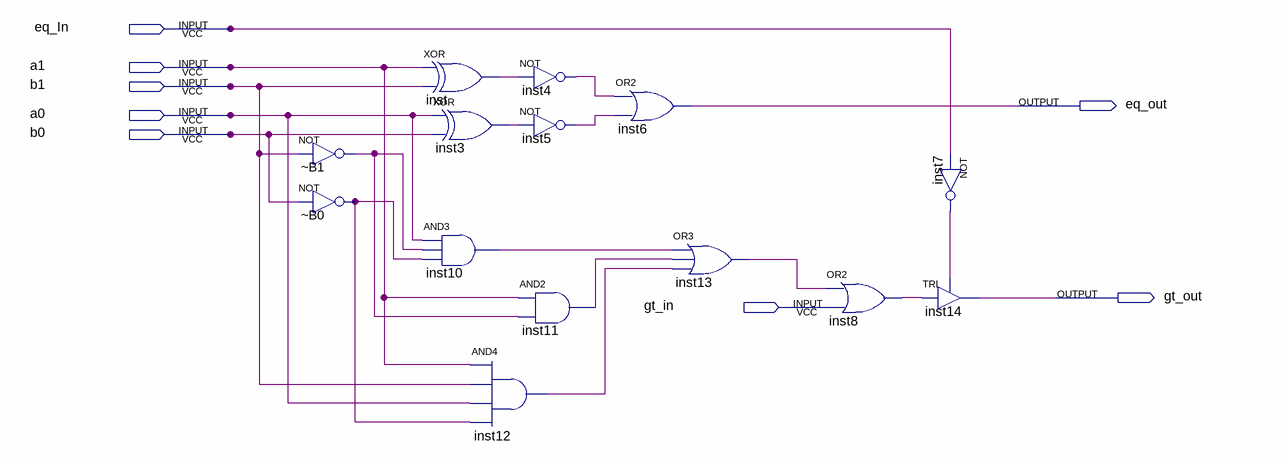
[diagram p0: schematic sheet]
// Quartus schematic 2BitComparator.bdf as structural Verilog: 14 symbols, 8 pins
module \2BitComparator  (
  input  eq_In,
  input  a1,
  input  b1,
  input  a0,
  input  b0,
  input  gt_in,
  output eq_out,
  output gt_out
);

  wire _B0_out, _B1_out, inst3_out, inst4_out, inst5_out, inst7_out, inst8_out, inst10_out, inst11_out,
       inst12_out, inst13_out, inst_out;

  not \u_~B1  (_B1_out, b1);
  not \u_~B0  (_B0_out, b0);
  xor inst (inst_out, a1, b1);
  xor inst3 (inst3_out, a0, b0);
  and inst10 (inst10_out, a0, _B1_out, _B0_out);
  not inst4 (inst4_out, inst_out);
  not inst5 (inst5_out, inst3_out);
  and inst11 (inst11_out, a1, _B1_out);
  and inst12 (inst12_out, a1, b1, a0, _B0_out);
  or inst6 (eq_out, inst4_out, inst5_out);
  or inst13 (inst13_out, inst10_out, inst11_out, inst12_out);
  or inst8 (inst8_out, inst13_out, gt_in);
  not inst7 (inst7_out, eq_In);
  TRI inst14 (.IN(inst8_out), .OE(inst7_out), .OUT(gt_out));
endmodule
